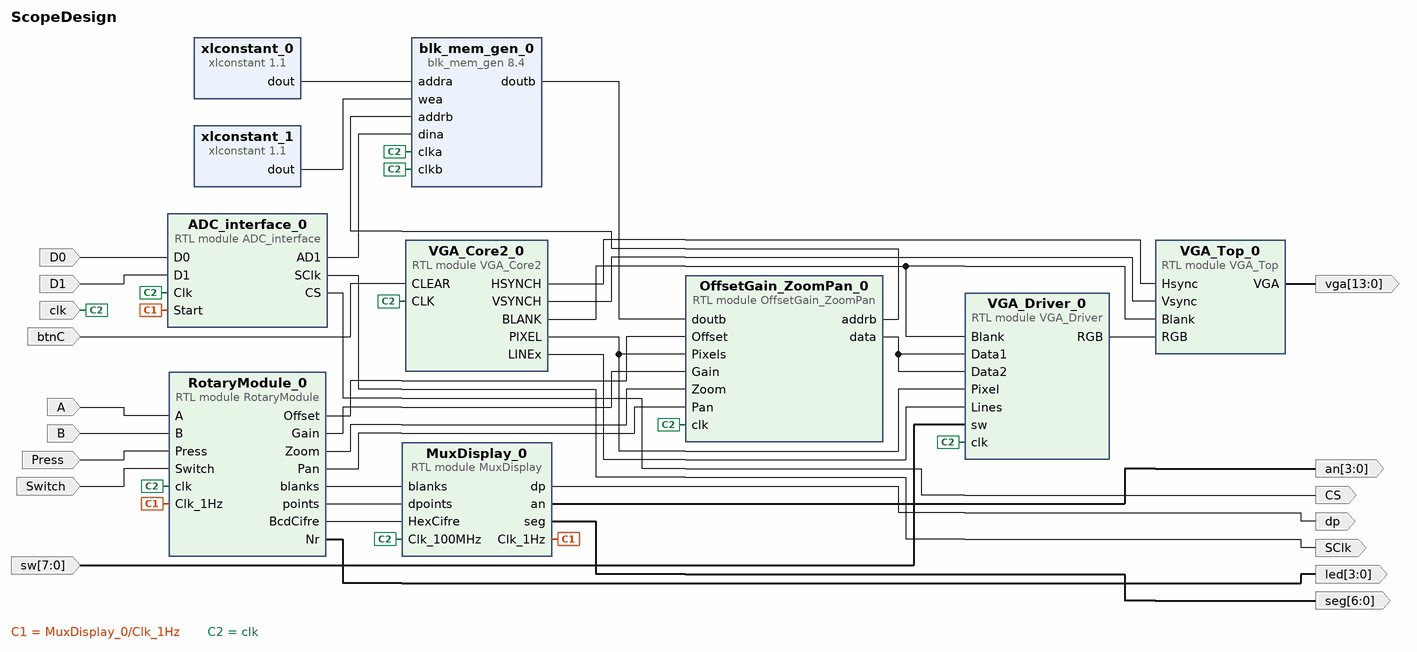
[diagram p0: block diagram of the top level]
# Vivado block design ScopeDesign, xc7a35tcpg236-1, Vivado 2019.1
create_bd_design ScopeDesign

create_bd_port -dir I A
create_bd_port -dir I B
create_bd_port -dir I Press
create_bd_port -dir I Switch
create_bd_port -dir I btnC
create_bd_port -dir I clk
create_bd_port -dir I -from 7 -to 0 sw
create_bd_port -dir O -from 3 -to 0 led
create_bd_port -dir O -from 3 -to 0 an
create_bd_port -dir O -from 6 -to 0 seg
create_bd_port -dir O dp
create_bd_port -dir O -from 13 -to 0 vga
create_bd_port -dir O SClk
create_bd_port -dir O CS
create_bd_port -dir I D0
create_bd_port -dir I D1

create_bd_cell -type ip -vlnv xilinx.com:ip:blk_mem_gen:8.4 blk_mem_gen_0
set_property -dict [list \
  CONFIG.Coe_File ../../../../../../../../Filer/Sinus_v2019.coe \
  CONFIG.Enable_32bit_Address false \
  CONFIG.Enable_A Always_Enabled \
  CONFIG.Enable_B Always_Enabled \
  CONFIG.Load_Init_File true \
  CONFIG.Memory_Type Simple_Dual_Port_RAM \
  CONFIG.Operating_Mode_A NO_CHANGE \
  CONFIG.Port_A_Write_Rate 50 \
  CONFIG.Port_B_Clock 100 \
  CONFIG.Port_B_Enable_Rate 100 \
  CONFIG.Read_Width_B 12 \
  CONFIG.Register_PortB_Output_of_Memory_Core true \
  CONFIG.Register_PortB_Output_of_Memory_Primitives false \
  CONFIG.Use_Byte_Write_Enable false \
  CONFIG.Use_RSTB_Pin false \
  CONFIG.Write_Depth_A 4096 \
  CONFIG.Write_Width_A 12 \
  CONFIG.Write_Width_B 12 \
  CONFIG.use_bram_block Stand_Alone \
] [get_bd_cells blk_mem_gen_0]
create_bd_cell -type module -reference OffsetGain_ZoomPan OffsetGain_ZoomPan_0
create_bd_cell -type module -reference RotaryModule RotaryModule_0
create_bd_cell -type module -reference VGA_Core2 VGA_Core2_0
create_bd_cell -type module -reference VGA_Driver VGA_Driver_0
create_bd_cell -type module -reference VGA_Top VGA_Top_0
create_bd_cell -type module -reference MuxDisplay MuxDisplay_0
create_bd_cell -type module -reference ADC_interface ADC_interface_0
create_bd_cell -type ip -vlnv xilinx.com:ip:xlconstant:1.1 xlconstant_0
set_property -dict {CONFIG.CONST_WIDTH 12} [get_bd_cells xlconstant_0]
create_bd_cell -type ip -vlnv xilinx.com:ip:xlconstant:1.1 xlconstant_1
set_property -dict {CONFIG.CONST_VAL 1} [get_bd_cells xlconstant_1]

# ---- connections ----

connect_bd_net [get_bd_ports A] [get_bd_pins RotaryModule_0/A]
connect_bd_net [get_bd_ports B] [get_bd_pins RotaryModule_0/B]
connect_bd_net [get_bd_ports Press] [get_bd_pins RotaryModule_0/Press]
connect_bd_net [get_bd_ports Switch] [get_bd_pins RotaryModule_0/Switch]
connect_bd_net [get_bd_ports btnC] [get_bd_pins VGA_Core2_0/CLEAR]
connect_bd_net [get_bd_ports sw] [get_bd_pins VGA_Driver_0/sw]
connect_bd_net [get_bd_pins VGA_Driver_0/RGB] [get_bd_pins VGA_Top_0/RGB]
connect_bd_net [get_bd_pins VGA_Core2_0/HSYNCH] [get_bd_pins VGA_Top_0/Hsync]
connect_bd_net [get_bd_pins VGA_Core2_0/VSYNCH] [get_bd_pins VGA_Top_0/Vsync]
connect_bd_net [get_bd_pins VGA_Core2_0/BLANK] [get_bd_pins VGA_Top_0/Blank] [get_bd_pins VGA_Driver_0/Blank]
connect_bd_net [get_bd_pins OffsetGain_ZoomPan_0/addrb] [get_bd_pins blk_mem_gen_0/addrb]
connect_bd_net [get_bd_pins OffsetGain_ZoomPan_0/data] [get_bd_pins VGA_Driver_0/Data1] [get_bd_pins VGA_Driver_0/Data2]
connect_bd_net [get_bd_pins VGA_Core2_0/LINEx] [get_bd_pins VGA_Driver_0/Lines]
connect_bd_net [get_bd_pins VGA_Core2_0/PIXEL] [get_bd_pins VGA_Driver_0/Pixel] [get_bd_pins OffsetGain_ZoomPan_0/Pixels]
connect_bd_net [get_bd_pins blk_mem_gen_0/doutb] [get_bd_pins OffsetGain_ZoomPan_0/doutb]
connect_bd_net [get_bd_pins RotaryModule_0/Nr] [get_bd_ports led]
connect_bd_net [get_bd_pins VGA_Top_0/VGA] [get_bd_ports vga]
connect_bd_net [get_bd_pins RotaryModule_0/Offset] [get_bd_pins OffsetGain_ZoomPan_0/Offset]
connect_bd_net [get_bd_pins RotaryModule_0/Gain] [get_bd_pins OffsetGain_ZoomPan_0/Gain]
connect_bd_net [get_bd_pins RotaryModule_0/Zoom] [get_bd_pins OffsetGain_ZoomPan_0/Zoom]
connect_bd_net [get_bd_pins RotaryModule_0/Pan] [get_bd_pins OffsetGain_ZoomPan_0/Pan]
connect_bd_net [get_bd_pins MuxDisplay_0/Clk_1Hz] [get_bd_pins RotaryModule_0/Clk_1Hz] [get_bd_pins ADC_interface_0/Start]
connect_bd_net [get_bd_pins MuxDisplay_0/seg] [get_bd_ports seg]
connect_bd_net [get_bd_pins MuxDisplay_0/dp] [get_bd_ports dp]
connect_bd_net [get_bd_pins MuxDisplay_0/an] [get_bd_ports an]
connect_bd_net [get_bd_pins RotaryModule_0/blanks] [get_bd_pins MuxDisplay_0/blanks]
connect_bd_net [get_bd_pins RotaryModule_0/points] [get_bd_pins MuxDisplay_0/dpoints]
connect_bd_net [get_bd_pins RotaryModule_0/BcdCifre] [get_bd_pins MuxDisplay_0/HexCifre]
connect_bd_net [get_bd_pins ADC_interface_0/AD1] [get_bd_pins blk_mem_gen_0/dina]
connect_bd_net -net D0_1 [get_bd_ports D0] [get_bd_pins ADC_interface_0/D0]
connect_bd_net -net D1_1 [get_bd_ports D1] [get_bd_pins ADC_interface_0/D1]
connect_bd_net [get_bd_pins ADC_interface_0/SClk] [get_bd_ports SClk]
connect_bd_net [get_bd_pins ADC_interface_0/CS] [get_bd_ports CS]
connect_bd_net [get_bd_pins xlconstant_0/dout] [get_bd_pins blk_mem_gen_0/addra]
connect_bd_net [get_bd_pins xlconstant_1/dout] [get_bd_pins blk_mem_gen_0/wea]
connect_bd_net [get_bd_ports clk] \
  [get_bd_pins RotaryModule_0/clk] [get_bd_pins VGA_Core2_0/CLK] [get_bd_pins OffsetGain_ZoomPan_0/clk] \
  [get_bd_pins blk_mem_gen_0/clka] [get_bd_pins blk_mem_gen_0/clkb] [get_bd_pins VGA_Driver_0/clk] \
  [get_bd_pins MuxDisplay_0/Clk_100MHz] [get_bd_pins ADC_interface_0/Clk]

validate_bd_design
save_bd_design
